# EAGLE design circuit (EAGLE 9.6.2)
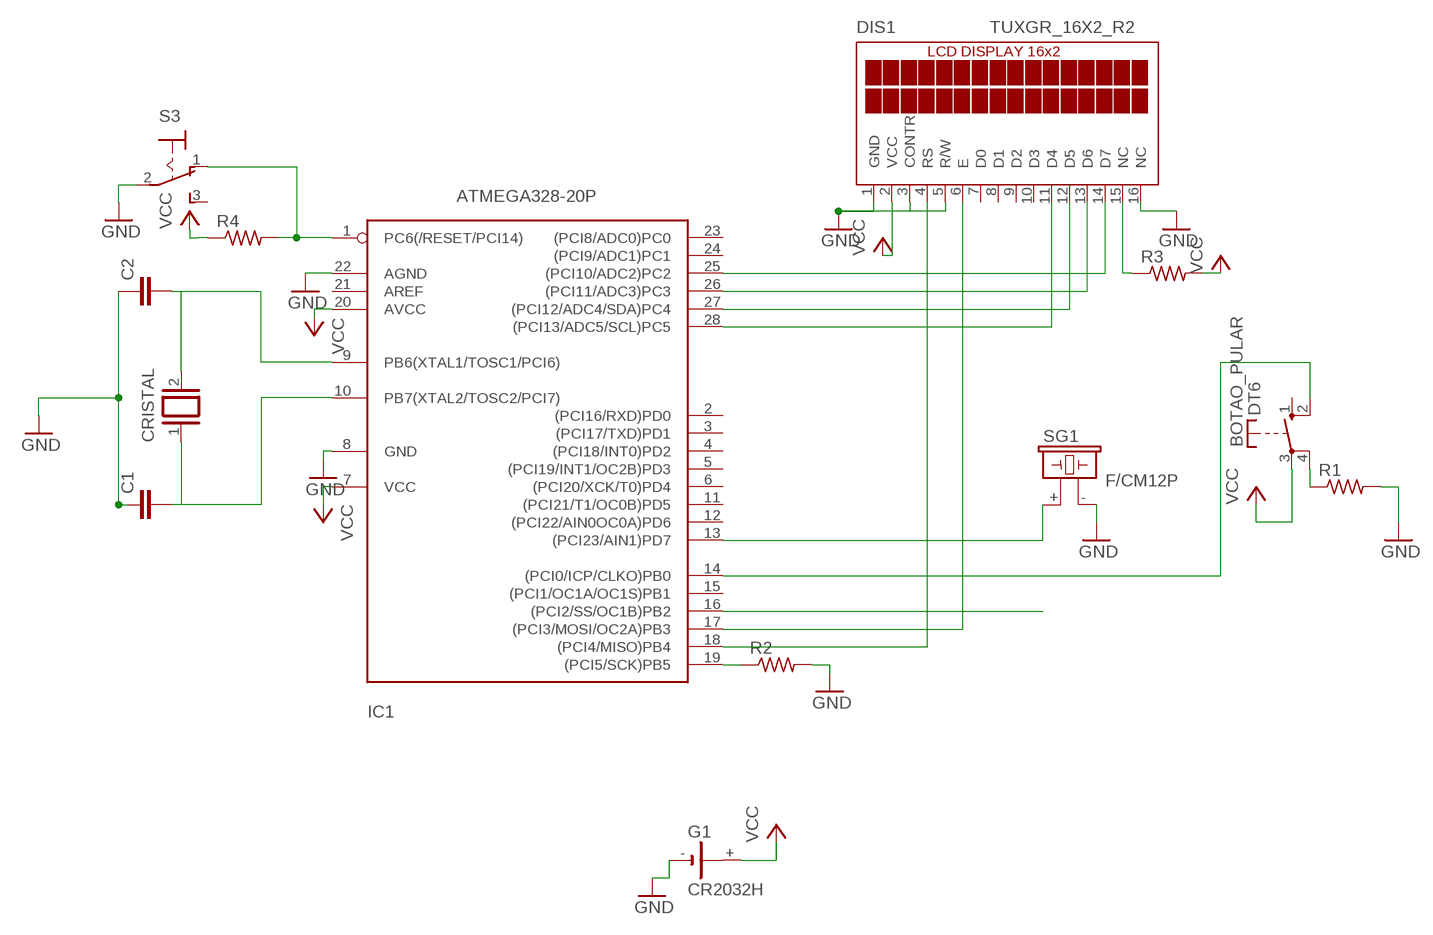
[diagram p0: schematic, sheet 1]

## Parts
BOTAO_PULAR  DT6  [DT6]
C1  C5/3.5  [C5B3.5]
C2  C5/3.5  [C5B3.5]
CRISTAL  XTAL/S  [QS]
DIS1  TUXGR_16X2_R2  [TUXGR_16X2_R2]
G1  CR2032H  [CR2032H]
IC1  ATMEGA328-20P  [DIL28-3]
R1  R-US_0204/7  [0204/7]
R2  R-US_0204/7  [0204/7]
R3  R-US_0204/7  [0204/7]
R4  R-US_0204/7  [0204/7]
S3  320-916  [320-916]
SG1  F/CM12P  [F/CM12P]

## Nets
GND [5V]: C1.1 C2.1 DIS1.1(GND) DIS1.3(CONTR) DIS1.5(R/W) DIS1.16(NC) G1.- IC1.8(GND) IC1.22(AGND) R1.2 R2.2 S3.2(P) SG1.-
N$1: IC1.13((PCI23/AIN1)PD7) SG1.+
N$2: IC1.19((PCI5/SCK)PB5) R2.1
N$3: DIS1.15(NC) R3.1
N$4: IC1.1(PC6(/RESET/PCI14)) R4.2 S3.1(O)
N$5: C1.2 CRISTAL.1 IC1.10(PB7(XTAL2/TOSC2/PCI7))
N$6: C2.2 CRISTAL.2 IC1.9(PB6(XTAL1/TOSC1/PCI6))
N$9: DIS1.4(RS) IC1.18((PCI4/MISO)PB4)
N$10: DIS1.6(E) IC1.17((PCI3/MOSI/OC2A)PB3)
N$11: DIS1.11(D4) IC1.28((PCI13/ADC5/SCL)PC5)
N$12: DIS1.12(D5) IC1.27((PCI12/ADC4/SDA)PC4)
N$13: DIS1.13(D6) IC1.26((PCI11/ADC3)PC3)
N$15: DIS1.14(D7) IC1.25((PCI10/ADC2)PC2)
N$16: IC1.16((PCI2/SS/OC1B)PB2)
N$17: BOTAO_PULAR.4(P) R1.1
N$19: BOTAO_PULAR.2(S) IC1.14((PCI0/ICP/CLKO)PB0)
VCC [5V]: BOTAO_PULAR.3(P) DIS1.2(VCC) G1.+ IC1.7(VCC) IC1.20(AVCC) R3.2 R4.1
Unconnected: BOTAO_PULAR.1(S) DIS1.7(D0) DIS1.8(D1) DIS1.9(D2) DIS1.10(D3) G1.+@1(+) IC1.2((PCI16/RXD)PD0) IC1.3((PCI17/TXD)PD1) IC1.4((PCI18/INT0)PD2) IC1.5((PCI19/INT1/OC2B)PD3) IC1.6((PCI20/XCK/T0)PD4) IC1.11((PCI21/T1/OC0B)PD5) IC1.12((PCI22/AIN0OC0A)PD6) IC1.15((PCI1/OC1A/OC1S)PB1) IC1.21(AREF) IC1.23((PCI8/ADC0)PC0) IC1.24((PCI9/ADC1)PC1) S3.3(S)

## Library data of the parts
BOTAO_PULAR = switch-misc:DT: ITT SWITCH
C1 C2 = capacitor-wima:C: CAPACITOR naming: grid - package width
CRISTAL = special:XTAL/S: CRYSTAL
DIS1 = display-lcd:TUXGR_16X2_R2: Tuxgraphics LCD display 16x2 characters reflective, without background light Source: tuxgr_12x2_r2.pdf; OC_FARNELL: unknown; OC_NEWARK: unknown
G1 = battery:CR2032H: LI BATTERY Varta
IC1 = atmega328:ATMEGA328*P: MICROCONTROLLER 32 kBytes FLASH 2 kBytes SRAM 1 kBytes EEPROM USART 8-channel 10 bit ADC
R1-R4 = rcl:R-US_: RESISTOR, American symbol; SPICEPREFIX: R
S3 = switch:320-916: TOGGLE SWITCH distributor RS Components
SG1 = buzzer:F/CM12P: BUZZER Source: Buerklin; OC_FARNELL: unknown; OC_NEWARK: unknown

## Net classes
0 default: width 0.5 mm
1 5V: width 1 mm

## Board
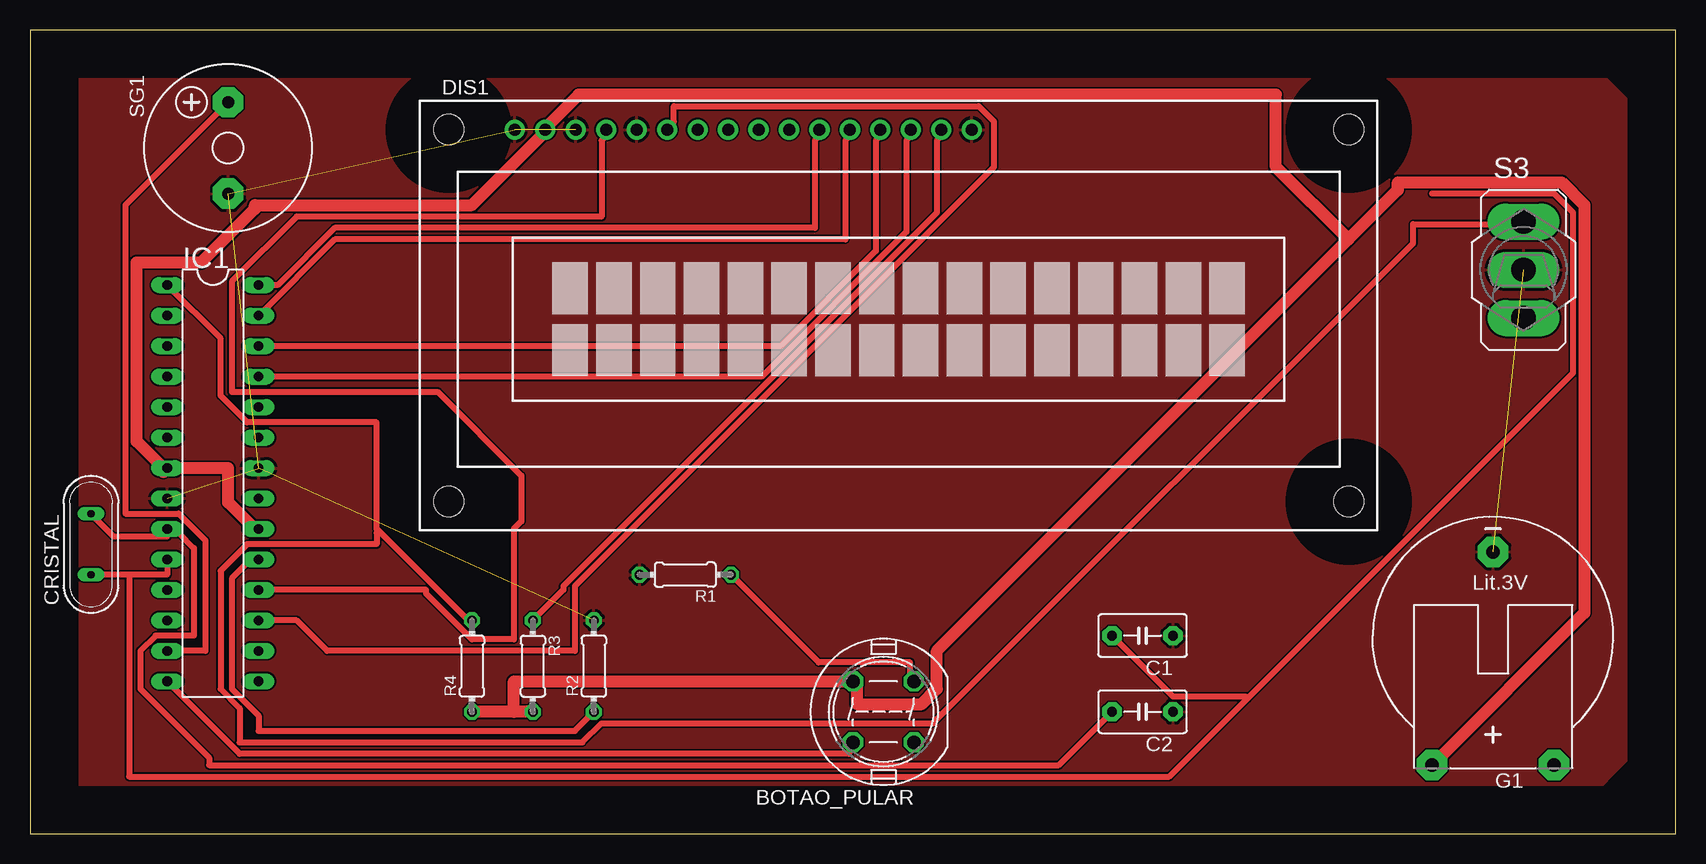
[diagram p1: board, top side]

Size 137.14 x 66.98 mm. Coordinates in mm from the lower left corner, seen from the top.
Outline: 0,0 137.14,0 137.14,66.98 0,66.98 0,0
Copper layers (1*16): Top 0.035mm / dielectric 1.5mm / Bottom 0.035mm
Design rules "default *": minimum track width 6mil, minimum drill 0.35mm, track to track 6mil, track to pad 6mil, pad to pad 6mil, via to via 6mil, smd to smd 6mil, copper to edge 4mm, drill to drill 1mm, minimum pad ring 10mil, minimum via ring 8mil, stop-mask expansion 4mil, vias tented up to drill 0mil, thermal gap 10mil

### Footprints (pad centres in the part's own frame; a part is rotated, then mirrored left to right if it is on the bottom)
DT6 = drill 1.118 octagon: 1 -2.54,2.54; 2 2.54,2.54; 3 2.54,-2.54; 4 -2.54,-2.54
C5B3.5 = drill 0.813 pad 1.6 octagon: 1 -2.54,0; 2 2.54,0
QS = drill 0.61 long: 1 -2.54,0; 2 2.54,0
TUXGR_16X2_R2 = drill 1 pad 1.676: 1 -32,15.5; 2 -29.46,15.5; 3 -26.92,15.5; 4 -24.38,15.5; 5 -21.84,15.5; 6 -19.3,15.5; 7 -16.76,15.5; 8 -14.22,15.5; 9 -11.68,15.5; 10 -9.14,15.5; 11 -6.6,15.5; 12 -4.06,15.5; 13 -1.52,15.5; 14 1.02,15.5; 15 3.56,15.5; 16 6.1,15.5 | hole 2.5: -37.5,-15.5; 37.5,-15.5; -37.5,15.5; 37.5,15.5
CR2032H = drill 1.118 pad 2.54 octagon: + 5.08,10.795; +@1 -5.08,10.795; - 0,-6.985
DIL28-3 = drill 0.813 long: 1 -16.51,-3.81; 2 -13.97,-3.81; 3 -11.43,-3.81; 4 -8.89,-3.81; 5 -6.35,-3.81; 6 -3.81,-3.81; 7 -1.27,-3.81; 8 1.27,-3.81; 9 3.81,-3.81; 10 6.35,-3.81; 11 8.89,-3.81; 12 11.43,-3.81; 13 13.97,-3.81; 14 16.51,-3.81; 15 16.51,3.81; 16 13.97,3.81; 17 11.43,3.81; 18 8.89,3.81; 19 6.35,3.81; 20 3.81,3.81; 21 1.27,3.81; 22 -1.27,3.81; 23 -3.81,3.81; 24 -6.35,3.81; 25 -8.89,3.81; 26 -11.43,3.81; 27 -13.97,3.81; 28 -16.51,3.81
0204/7 = drill 0.813 octagon: 1 -3.81,0; 2 3.81,0
320-916 = drill 2.007 long: 1 0,4.013; 2 0,0; 3 0,-4.013
F/CM12P = drill 1.016 pad 2.54 octagon: + 3.81,0; - -3.81,0

### Placement (x,y rotation side)
BOTAO_PULAR  71.12,10.16 180 top
C1  92.71,16.51 180 top
C2  92.71,10.16 180 top
CRISTAL  5.08,24.13 90 top
DIS1  72.39,43.18 0 top
G1  121.92,16.51 180 top
IC1  15.24,29.21 270 top
R1  54.61,21.59 180 top
R2  46.99,13.97 90 top
R3  41.91,13.97 270 top
R4  36.83,13.97 90 top
S3  124.46,46.99 0 top
SG1  16.51,57.15 90 top

### Tracks (layer width: path | path; a pad name or v marks a point on that pad's centre or on a via)
GND  (6 unrouted)
  pour Top: 2.54,1.27 128.27,1.27 134.62,7.62 134.62,59.69 128.27,66.04 127,66.04 3.81,66.04 2.54,64.77 1.27,63.5 1.27,6.35 1.27,2.54
N$1
  Top 0.5: IC1.13 14.61,15.24 14.61,24.45 12.38,26.67 7.94,26.67 7.94,52.39 SG1.+
N$2
  Top 0.5: R2.1 45.4,8.57 19.05,8.57 19.05,9.84 16.83,12.06 16.83,21.27 18.41,22.86 IC1.19
N$3
  Top 0.5: R3.1 44.45,20.32 44.45,20.64 75.56,51.75 75.56,57.79 75.88,58.1 75.88,58.42 DIS1.15
N$4
  Top 0.5: IC1.1 15.88,41.27 15.88,36.51 18.1,34.29 28.89,34.29 28.89,25.4 29.05,25.24 | 29.05,25.24 36.51,17.78 R4.2 | S3.1 124.46,50.8 115.25,50.8 115.25,49.21 75.25,9.21 47.62,9.21 46.04,7.62 17.46,7.62 17.46,10.48 15.88,12.06 15.88,21.91 18.1,24.13 28.89,24.13 28.89,25.08 29.05,25.24
N$5
  Top 0.5: 8.25,21.59 11.43,21.59 IC1.10 | 8.25,21.59 CRISTAL.1 | 116.84,53.34 127,53.34 128.59,51.75 128.59,38.42 101.44,11.27 | 101.44,11.27 94.93,4.76 8.25,4.76 8.25,21.59 | C1.2 95.25,11.43 101.28,11.43 101.44,11.27
N$6
  Top 0.5: CRISTAL.2 6.98,24.76 11.43,24.76 11.43,25.08 | 11.43,25.08 12.38,25.08 13.65,23.81 13.65,16.51 10.48,16.51 9.21,15.24 9.21,12.06 14.92,6.35 14.92,5.71 85.72,5.71 C2.2 | 11.43,25.08 IC1.9
N$9
  Top 0.5: IC1.18 33.02,20.32 33.02,20 36.83,16.19 40.32,16.19 40.32,25.4 40.96,26.03 40.96,29.84 33.97,36.83 16.83,36.83 16.83,46.04 22.22,51.43 47.62,51.43 47.62,57.79 47.94,58.1 47.94,58.42 DIS1.4
N$10
  Top 0.5: IC1.17 22.22,17.78 24.77,15.24 45.4,15.24 45.4,20.64 80.33,55.56 80.33,59.37 79.06,60.64 53.66,60.64 53.66,59.37 53.34,59.05 53.34,58.74 DIS1.6
N$11
  Top 0.5: IC1.28 20.64,45.72 25.4,50.48 65.41,50.48 65.41,57.79 65.72,58.1 65.72,58.42 DIS1.11
N$12
  Top 0.5: IC1.27 25.4,49.53 67.94,49.53 67.94,57.79 68.26,58.1 68.26,58.42 DIS1.12
N$13
  Top 0.5: IC1.26 62.55,40.64 70.48,48.58 70.48,57.79 70.8,58.1 70.8,58.42 DIS1.13
N$15
  Top 0.5: IC1.25 60.96,38.1 73.03,50.16 73.03,57.79 73.34,58.1 73.34,58.42 DIS1.14
N$17
  Top 0.5: R1.1 65.72,14.29 73.34,14.29 73.34,13.02 BOTAO_PULAR.4
N$19
  Top 0.5: IC1.14 17.46,6.67 68.26,6.67 68.26,7.3 BOTAO_PULAR.2
VCC
  Top 1: IC1.20 18.73,25.4 16.51,27.62 16.51,30.48 IC1.7 11.11,30.16 10.79,30.48 10.79,30.8 8.89,32.7 8.89,47.62 14.29,47.62 18.73,52.07 18.73,52.39 36.83,52.39 42.86,58.42 DIS1.2 43.18,59.05 45.72,61.59 103.82,61.59 103.82,55.56 109.86,49.53 | R3.2 40.32,10.16 | 40.32,10.16 R4.1 | 40.32,10.16 40.32,12.7 BOTAO_PULAR.3 68.9,12.38 68.9,10.79 74.3,10.79 75.56,12.06 75.56,15.24 109.86,49.53 | G1.+ 129.54,18.41 129.54,52.39 127.64,54.29 113.98,54.29 113.98,53.66 109.86,49.53